# EAGLE design rev3.01 (EAGLE 9.2.2)
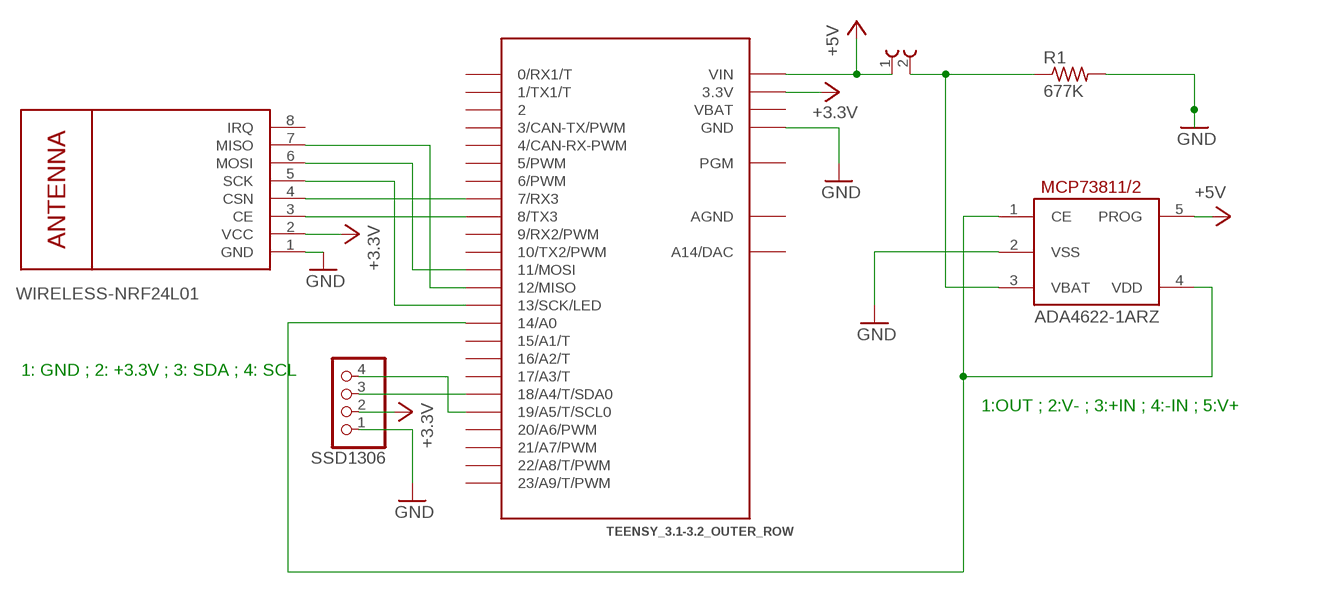
[diagram p0: schematic, sheet 1]

## Parts
ADA4622-1ARZ  MCP73811/2  [SOT23-5L]
M1  WIRELESS-NRF24L01  [WIRELESS-NRF24L01]
R1  677K  R-US_R0805W  [R0805W]
R_MES  691214310002  [691214310002]
SSD1306  PINHD-1X4  [1X04]
U$2  TEENSY_3.1-3.2_OUTER_ROW  [TEENSY_3.0-3.2&LC_OUTER_ROW]

## Nets
+5V: ADA4622-1ARZ.5(PROG) R_MES.1 U$2.VIN
GND: ADA4622-1ARZ.2(VSS) M1.1(GND) R1.2 SSD1306.1 U$2.GND U$2.GND1(GND)
N$1: ADA4622-1ARZ.3(VBAT) R1.1 R_MES.2
N$2: SSD1306.3 U$2.18/A4(18/A4/T/SDA0)
N$3: SSD1306.4 U$2.19/A5(19/A5/T/SCL0)
N$4: M1.7(MISO) U$2.12(12/MISO)
N$5: ADA4622-1ARZ.1(CE) ADA4622-1ARZ.4(VDD) U$2.14/A0
N$6: M1.6(MOSI) U$2.11(11/MOSI)
N$7: M1.5(SCK) U$2.13(13/SCK/LED)
N$8: M1.4(CSN) U$2.7(7/RX3)
N$9: M1.3(CE) U$2.8(8/TX3)
V+: M1.2(VCC) SSD1306.2 U$2.3.3V U$2.3.3V1(3.3V) ; supply symbol labelled +3.3V
Unconnected: M1.8(IRQ) U$2.0(0/RX1/T) U$2.1(1/TX1/T) U$2.2 U$2.3(3/CAN-TX/PWM) U$2.4(4/CAN-RX-PWM) U$2.5(5/PWM) U$2.6(6/PWM) U$2.9(9/RX2/PWM) U$2.10(10/TX2/PWM) U$2.15/A1(15/A1/T) U$2.16/A2(16/A2/T) U$2.17/A3(17/A3/T) U$2.20/A6(20/A6/PWM) U$2.21/A7(21/A7/PWM) U$2.22/A8(22/A8/T/PWM) U$2.23/A9(23/A9/T/PWM) U$2.PGM U$2.RESET/DAC(A14/DAC)

## Notes on the sheet
- 1: GND ; 2: +3.3V ; 3: SDA ; 4: SCL
- 1:OUT ; 2:V- ; 3:+IN ; 4:-IN ; 5:V+

## Power pins joined to a net without a drawn wire
AGND: U$2.AGND
VBAT: U$2.VBAT

## Library data of the parts
ADA4622-1ARZ = adafruit:MCP73811/2: MCP73811 and MCP73812 Simple, Miniature Single-Cell, Fully Integrated Li-Ion / Li-Polymer Charge Management Controllers SOT-23-5 package, no indicator LED but with adjustable current, small and very inexpensive
M1 = diy-modules:WIRELESS-NRF24L01: 2.4 GHz Wireless Module based on NRF24L01 chip More details available here: http://www.electrodragon.com/w/NRF24L01 Click here to find device on ebay.com <http://www.ebay.com/sch/nrf24l01+arduino>
R1 = adafruit:R-US_: RESISTOR, American symbol
R_MES = TerminalBlocks (rev17a):691214310002: WR-TBL Serie 2143 - 3.81mm Horizontal Entry Modular with Rising Cage Clamp - 1.3 mm2 Wires, 2 Pins=>Code : Con_TBL_Screw_RisingClamp_3.81_691214310002 <http://katalog.we-online.de/media/images/eican/Con_TBL_Screw_RisingClamp_3.81_69121431000x_pf2.jpg> Details see: http://katalog.we-online.de/en/em/TBL_3_81_2143_HORIZONTAL_ENTRY_MODULAR_69121431000X Created 2014-06-18, Karrer Zheng 2014 (C) Würth Elektronik
SSD1306 = pinhead:PINHD-1X4: PIN HEADER
U$2 = Teensy_3_and_LC_Series_Boards_v1.4:TEENSY_3.1-3.2_OUTER_ROW: Footprint for Teensy 3.1 or 3.2 board using all pin connections on the outer perimeter

## Net classes
0 default: width 0.305 mm, drill 0.254 mm, clearance 0.305 mm

## Board
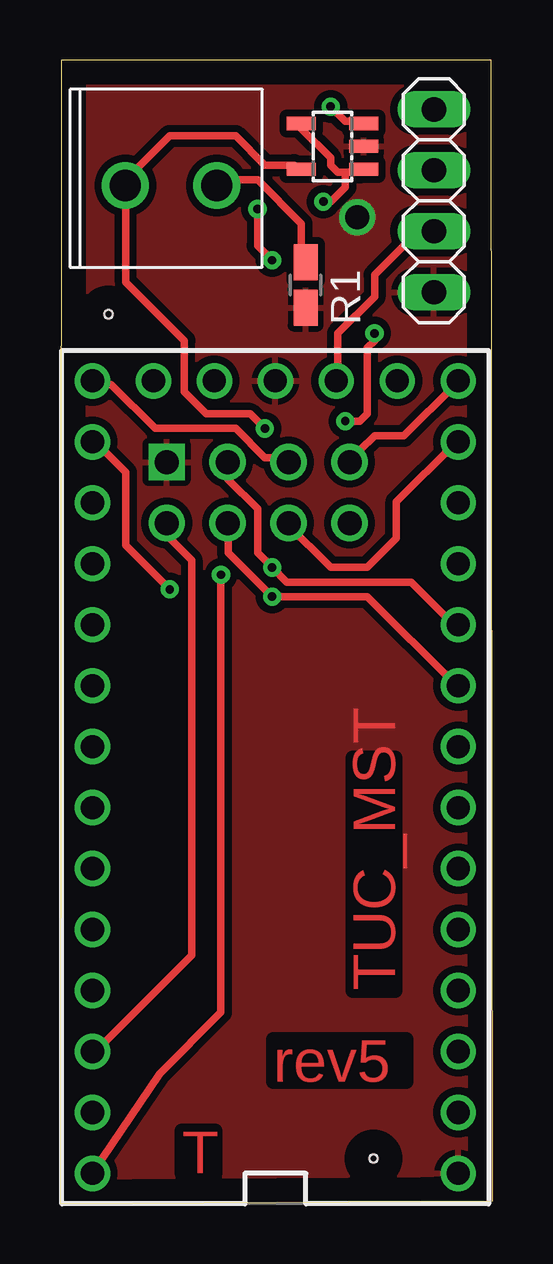
[diagram p1: board, top side]
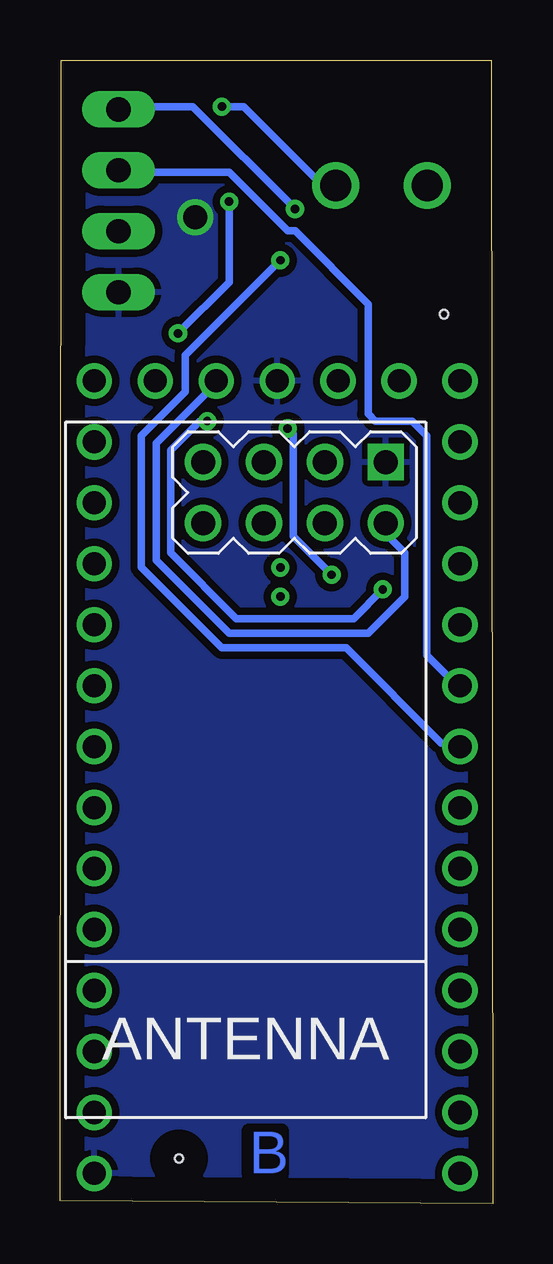
[diagram p2: board, bottom side, seen from below]

Size 18.02 x 47.66 mm. Coordinates in mm from the lower left corner, seen from the top.
Outline: 0,0 18.02,0.14 17.97,47.66 0.05,47.65 0,0
Copper layers (1*16): Top 0.035mm / dielectric 1.5mm / Bottom 0.035mm
Design rules "default": minimum track width 6mil, minimum drill 0.35mm, track to track 6mil, track to pad 6mil, pad to pad 6mil, via to via 6mil, smd to smd 6mil, copper to edge 40mil, drill to drill 6mil, minimum pad ring 10mil, minimum via ring 8mil, stop-mask expansion 4mil, vias tented up to drill 0mil, thermal gap 10mil
Holes 0.35 mm at 2.02,37.07 13.06,1.89

### Footprints (pad centres in the part's own frame; a part is rotated, then mirrored left to right if it is on the bottom)
SOT23-5L = smd 0.55 x 1.2: 1 -0.95,-1.3; 2 0,-1.3; 3 0.95,-1.3; 4 0.95,1.3; 5 -0.95,1.3
WIRELESS-NRF24L01 = drill 1 square: 1 -12.7,6.35 | drill 1: 2 -10.16,6.35; 3 -12.7,3.81; 4 -10.16,3.81; 5 -12.7,1.27; 6 -10.16,1.27; 7 -12.7,-1.27; 8 -10.16,-1.27
R0805W = smd 1.5 x 1: 1 -0.94,0; 2 0.94,0
691214310002 = drill 1.3: 1 -1.905,0; 2 1.905,0
1X04 = drill 1.016 long: 1 -3.81,0; 2 -1.27,0; 3 1.27,0; 4 3.81,0
TEENSY_3.0-3.2&LC_OUTER_ROW = drill 0.965: 0 -7.62,13.97; 1 -7.62,11.43; 2 -7.62,8.89; 3 -7.62,6.35; 3.3V 7.62,11.43; 3.3V1 -2.54,-16.51; 4 -7.62,3.81; 5 -7.62,1.27; 6 -7.62,-1.27; 7 -7.62,-3.81; 8 -7.62,-6.35; 9 -7.62,-8.89; 10 -7.62,-11.43; 11 -7.62,-13.97; 12 -7.62,-16.51; 13 7.62,-16.51; 14/A0 7.62,-13.97; 15/A1 7.62,-11.43; 16/A2 7.62,-8.89; 17/A3 7.62,-6.35; 18/A4 7.62,-3.81; 19/A5 7.62,-1.27; 20/A6 7.62,1.27; 21/A7 7.62,3.81; 22/A8 7.62,6.35; 23/A9 7.62,8.89; AGND 7.62,13.97; GND -7.62,16.51; GND1 0,-16.51; PGM 2.54,-16.51; RESET/DAC 5.08,-16.51; VBAT -5.08,-16.51; VIN 7.62,16.51

### Placement (x,y rotation side)
ADA4622-1ARZ  11.36,44.06 90 top
M1  10.79,18.21 270 bottom
R1  10.23,38.29 270 top
R_MES  4.63,42.43 0 top
SSD1306  15.58,41.8 90 top
U$2  8.97,17.78 180 top

### Tracks (layer width: path | path; a pad name or v marks a point on that pad's centre or on a via)
+5V  (via drill 0.35)
  Top 0.305: ADA4622-1ARZ.5 9.75,43.28 8.53,43.28 7.32,44.5 4.57,44.5 2.74,42.67 R_MES.1 2.74,42.37 2.74,38.41 5.18,35.97 5.18,33.83 6.1,32.92 7.92,32.92 v8.53,32.31 | U$2.VIN 4.16,5.43 6.71,7.98 v6.71,26.21
  Bottom 0.305: v8.53,32.31 8.31,32.09 8.31,27.82 v6.71,26.21
GND  (via drill 1)
  other vias: 12.39,41.11
  pour Top: -1.27,49.53 19.05,49.53 19.05,-1.27 -1.27,-1.27
  pour Bottom: -2.54,50.8 20.32,50.8 20.32,-2.54 -2.54,-2.54
N$1  (via drill 0.35)
  Top 0.305: v11.28,45.72 11.89,45.11 12.5,45.11 ADA4622-1ARZ.3 | R1.1 10.06,39.32 10.06,40.84 8.23,42.67 6.71,42.67 R_MES.2
  Bottom 0.305: v11.28,45.72 10.36,45.72 7.32,42.67 6.71,42.67 R_MES.2
N$2
  Bottom 0.305: U$2.18/A4 1.52,21.64 2.74,22.86 2.74,32 3.35,32.61 4.88,32.61 5.18,32.92 5.18,37.49 8.23,40.54 8.53,40.54 10.97,42.98 15.54,42.98 SSD1306.3
N$3  (via drill 0.35)
  Top 0.305: v8.84,39.32 8.23,39.93 v8.23,41.45
  Bottom 0.305: v8.84,39.32 12.8,35.36 12.8,33.83 14.63,32 14.63,26.52 11.28,23.16 6.1,23.16 2.13,19.2 1.52,19.2 U$2.19/A5 | v8.23,41.45 12.5,45.72 15.54,45.72 SSD1306.4
N$4
  Top 0.305: M1.7 11.89,31.09 12.19,31.39 12.5,31.39 13.11,32 14.33,32 16.46,34.14 U$2.12
N$5  (via drill 0.35)
  Top 0.305: 11.89,42.98 12.5,42.98 ADA4622-1ARZ.1 | 11.89,42.98 11.58,42.98 11.28,43.28 11.28,43.59 10.06,44.81 ADA4622-1ARZ.4 | 11.89,42.98 11.89,42.37 11.28,41.76 v10.97,41.76 | v13.11,36.27 13.11,35.97 12.8,35.66 12.8,32.92 12.5,32.61 v11.89,32.61 | v4.57,25.6 2.74,27.43 2.74,30.48 1.83,31.39 1.52,31.39 1.22,31.7 U$2.14/A0
  Bottom 0.305: v10.97,41.76 10.97,38.41 v13.11,36.27 | v11.89,32.61 12.19,32.61 13.41,31.39 13.41,27.13 10.67,24.38 5.79,24.38 v4.57,25.6
N$6
  Top 0.305: U$2.11 16.46,31.7 14.02,29.26 14.02,27.74 12.8,26.52 11.28,26.52 9.45,28.35 M1.6
N$7
  Top 0.305: U$2.13 1.52,34.14 2.13,34.14 3.96,32.31 7.32,32.31 8.53,31.09 9.45,31.09 M1.5
N$8  (via drill 0.35)
  Top 0.305: U$2.7 16.46,21.64 12.8,25.3 v8.84,25.3 7.01,27.13 7.01,28.35 M1.4
N$9  (via drill 0.35)
  Top 0.305: U$2.8 16.46,24.38 16.15,24.38 14.63,25.91 9.45,25.91 v8.84,26.52 8.23,27.13 8.23,28.96 7.01,30.18 7.01,30.79 M1.3
V+
  Top 0.305: U$2.3.3V1 11.58,34.44 11.58,36.27 13.11,37.8 13.11,38.71 14.63,40.23 15.54,40.23 SSD1306.2 | U$2.3.3V 1.52,6.4 5.49,10.36 5.49,26.82 4.57,27.74 4.57,28.35 M1.2
  Bottom 0.305: U$2.3.3V1 11.58,34.14 14.02,31.7 14.02,26.82 10.97,23.77 5.18,23.77 3.66,25.3 3.66,27.13 4.27,27.74 4.27,28.35 M1.2

### Text on the board
Top: TUC_MST | rev5 | T
Bottom: B